# EAGLE schematic motherboard_cp2 (EAGLE 6.4)
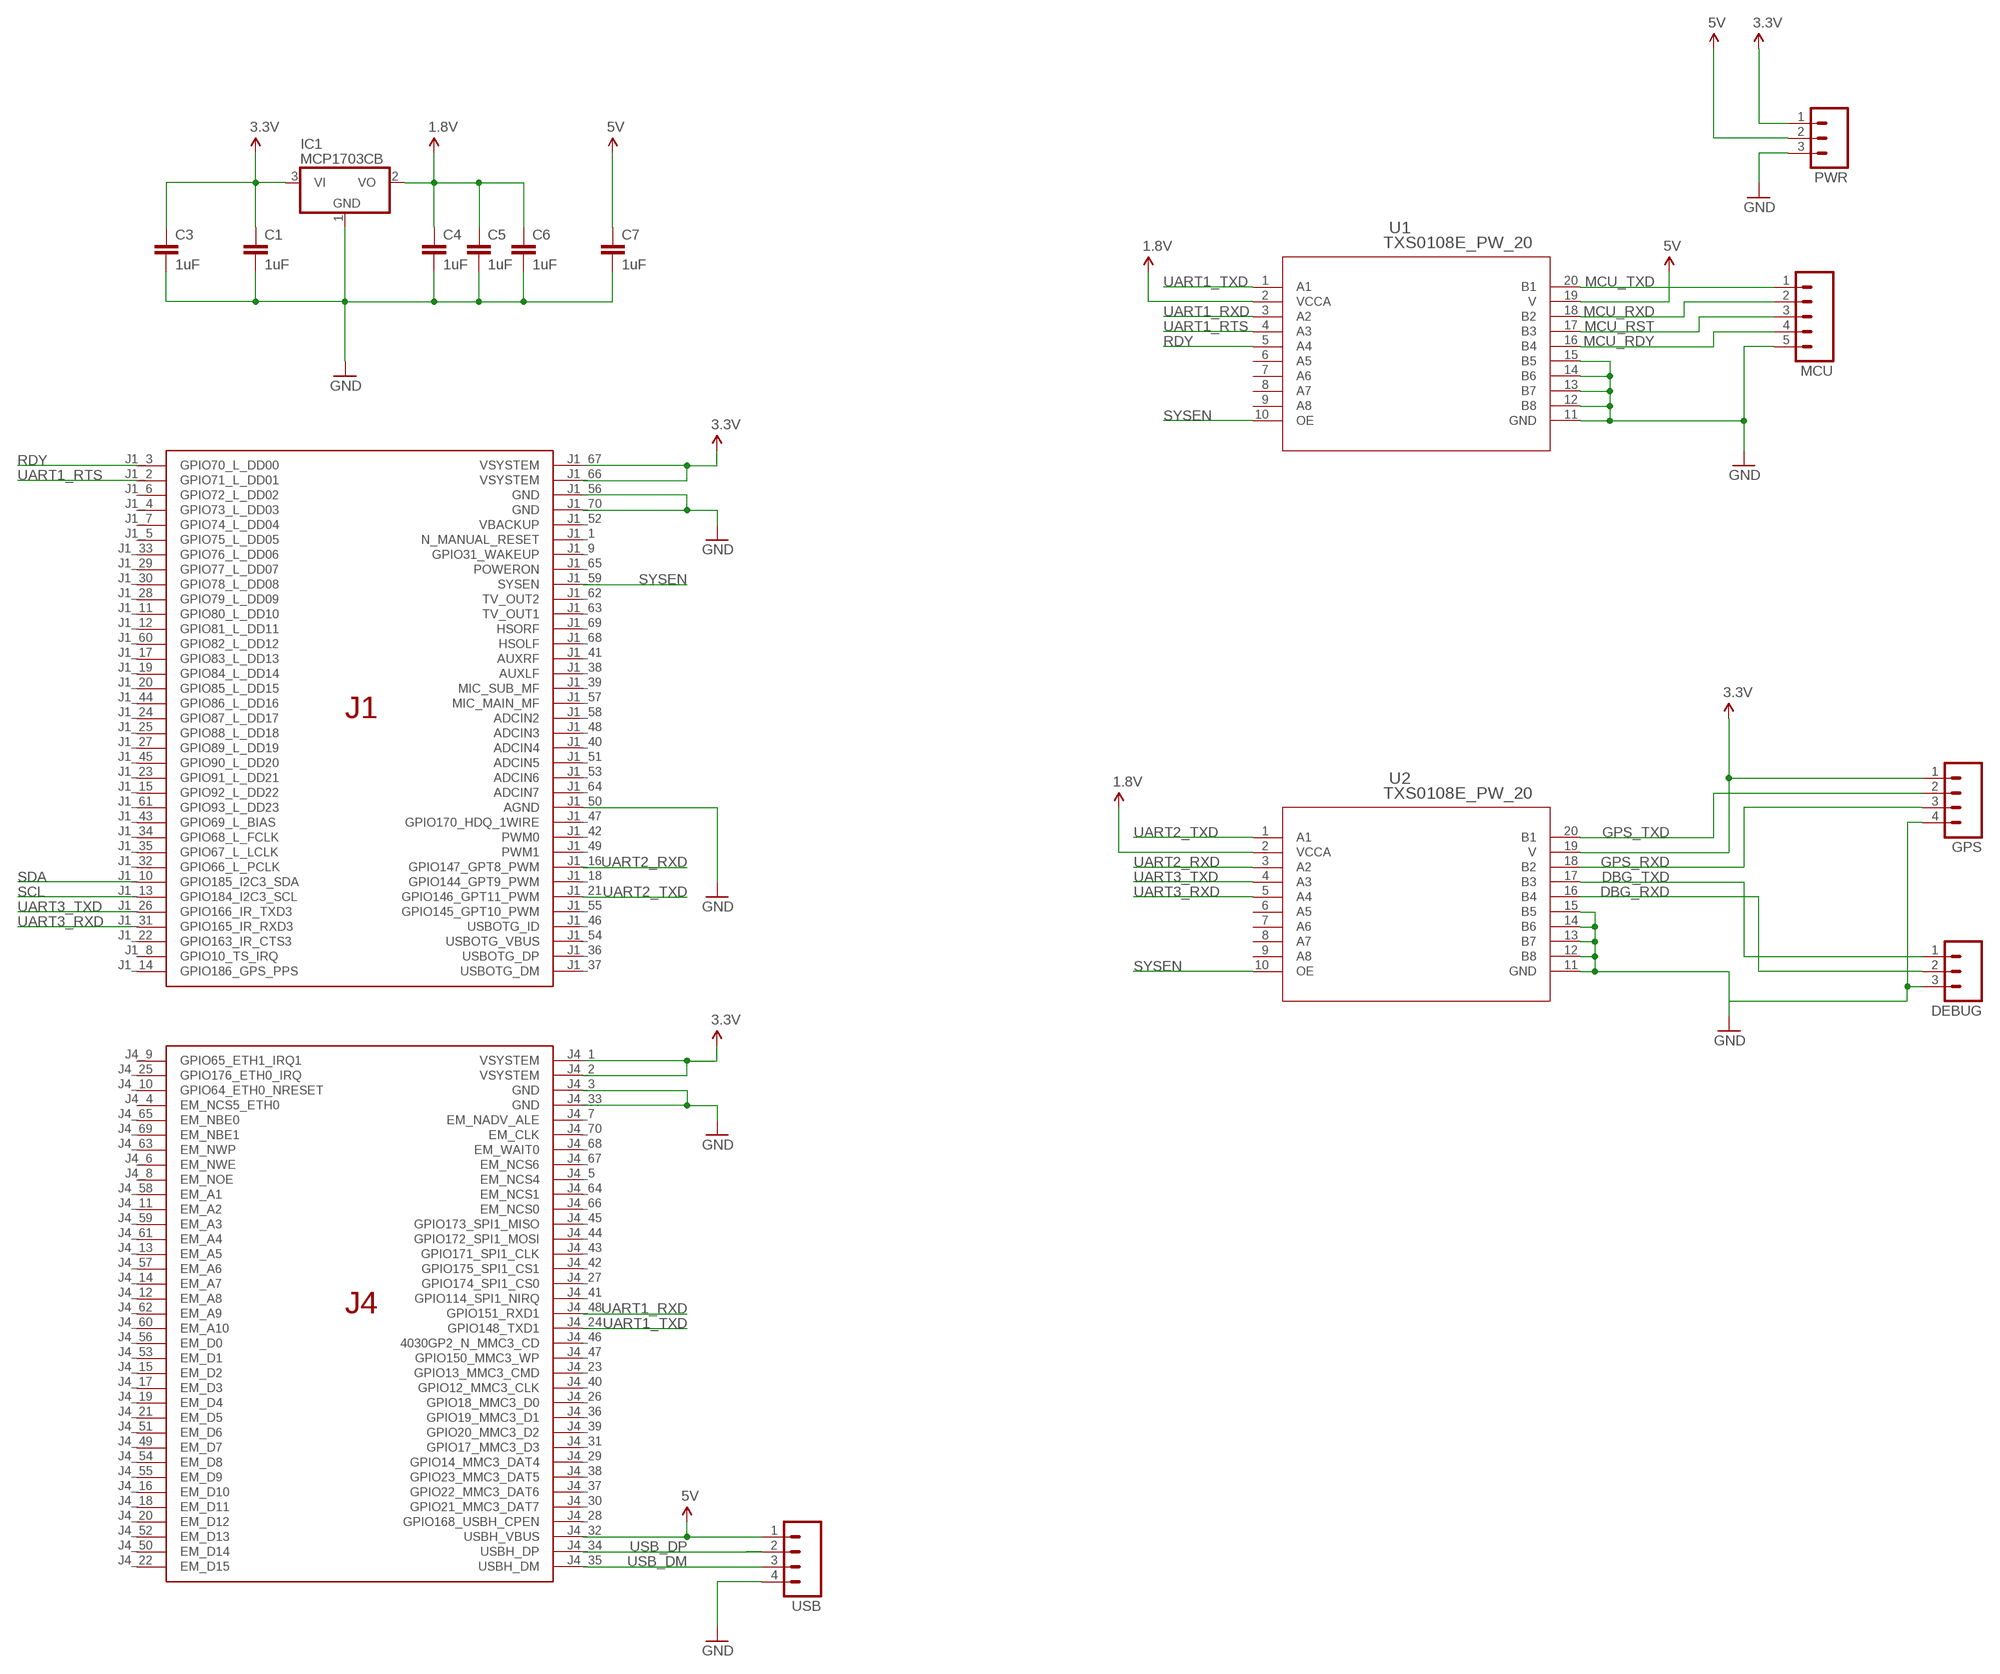
[diagram p0: schematic, sheet 1]

## Parts
C1  1uF  1UF-25V-10%(0805)  [0805]
C3  1uF  1UF-25V-10%(0805)  [0805]
C4  1uF  1UF-25V-10%(0805)  [0805]
C5  1uF  1UF-25V-10%(0805)  [0805]
C6  1uF  1UF-25V-10%(0805)  [0805]
C7  1uF  1UF-25V-10%(0805)  [0805]
DEBUG  M03LOCK_LONGPADS  [1X03_LOCK_LONGPADS]
GPS  M04LONGPADS  [1X04_LONGPADS]
IC1  MCP1703CB  [SOT23]
MCU  M05PTH_LONGPADS  [1X05_LONGPADS]
PWR  M03LONGPADS  [1X03_LONGPADS]
U1  TXS0108E_PW_20  [PW20]
U2  TXS0108E_PW_20  [PW20]
U$1  OVERO  [OVERO]
USB  M04LONGPADS  [1X04_LONGPADS]

## Nets
1.8V: C4.1 C5.1 C6.1 IC1.2(VO) U1.2(VCCA) U2.2(VCCA)
3.3V: C1.1 C3.1 GPS.1 IC1.3(VI) PWR.1 U2.19(V) U$1.J1_66(VSYSTEM) U$1.J1_67(VSYSTEM) U$1.J4_1(VSYSTEM) U$1.J4_2(VSYSTEM)
5V: C7.1 PWR.2 U1.19(V) U$1.J4_32(USBH_VBUS) USB.1
DBG_RXD: DEBUG.2 U2.16(B4)
DBG_TXD: DEBUG.1 U2.17(B3)
GND: C1.2 C3.2 C4.2 C5.2 C6.2 C7.2 DEBUG.3 GPS.4 IC1.1(GND) MCU.5 PWR.3 U1.11(GND) U1.12(B8) U1.13(B7) U1.14(B6) U1.15(B5) U2.11(GND) U2.12(B8) U2.13(B7) U2.14(B6) U2.15(B5) U$1.J1_50(AGND) U$1.J1_56(GND) U$1.J1_70(GND) U$1.J4_3(GND) U$1.J4_33(GND) USB.4
GPS_RXD: GPS.3 U2.18(B2)
GPS_TXD: GPS.2 U2.20(B1)
MCU_RDY: MCU.4 U1.16(B4)
MCU_RST: MCU.3 U1.17(B3)
MCU_RXD: MCU.2 U1.18(B2)
MCU_TXD: MCU.1 U1.20(B1)
RDY: U1.5(A4) U$1.J1_3(GPIO70_L_DD00)
SCL: U$1.J1_13(GPIO184_I2C3_SCL)
SDA: U$1.J1_10(GPIO185_I2C3_SDA)
SYSEN: U1.10(OE) U2.10(OE) U$1.J1_59(SYSEN)
UART1_RTS: U1.4(A3) U$1.J1_2(GPIO71_L_DD01)
UART1_RXD: U1.3(A2) U$1.J4_48(GPIO151_RXD1)
UART1_TXD: U1.1(A1) U$1.J4_24(GPIO148_TXD1)
UART2_RXD: U2.3(A2) U$1.J1_16(GPIO147_GPT8_PWM)
UART2_TXD: U2.1(A1) U$1.J1_21(GPIO146_GPT11_PWM)
UART3_RXD: U2.5(A4) U$1.J1_31(GPIO165_IR_RXD3)
UART3_TXD: U2.4(A3) U$1.J1_26(GPIO166_IR_TXD3)
USB_DM: U$1.J4_35(USBH_DM) USB.3
USB_DP: U$1.J4_34(USBH_DP) USB.2
Unconnected: U1.6(A5) U1.7(A6) U1.8(A7) U1.9(A8) U2.6(A5) U2.7(A6) U2.8(A7) U2.9(A8) U$1.J1_1(N_MANUAL_RESET) U$1.J1_4(GPIO73_L_DD03) U$1.J1_5(GPIO75_L_DD05) U$1.J1_6(GPIO72_L_DD02) U$1.J1_7(GPIO74_L_DD04) U$1.J1_8(GPIO10_TS_IRQ) U$1.J1_9(GPIO31_WAKEUP) U$1.J1_11(GPIO80_L_DD10) U$1.J1_12(GPIO81_L_DD11) U$1.J1_14(GPIO186_GPS_PPS) U$1.J1_15(GPIO92_L_DD22) U$1.J1_17(GPIO83_L_DD13) U$1.J1_18(GPIO144_GPT9_PWM) U$1.J1_19(GPIO84_L_DD14) U$1.J1_20(GPIO85_L_DD15) U$1.J1_22(GPIO163_IR_CTS3) U$1.J1_23(GPIO91_L_DD21) U$1.J1_24(GPIO87_L_DD17) U$1.J1_25(GPIO88_L_DD18) U$1.J1_27(GPIO89_L_DD19) U$1.J1_28(GPIO79_L_DD09) U$1.J1_29(GPIO77_L_DD07) U$1.J1_30(GPIO78_L_DD08) U$1.J1_32(GPIO66_L_PCLK) U$1.J1_33(GPIO76_L_DD06) U$1.J1_34(GPIO68_L_FCLK) U$1.J1_35(GPIO67_L_LCLK) U$1.J1_36(USBOTG_DP) U$1.J1_37(USBOTG_DM) U$1.J1_38(AUXLF) U$1.J1_39(MIC_SUB_MF) U$1.J1_40(ADCIN4) U$1.J1_41(AUXRF) U$1.J1_42(PWM0) U$1.J1_43(GPIO69_L_BIAS) U$1.J1_44(GPIO86_L_DD16) U$1.J1_45(GPIO90_L_DD20) U$1.J1_46(USBOTG_ID) U$1.J1_47(GPIO170_HDQ_1WIRE) U$1.J1_48(ADCIN3) U$1.J1_49(PWM1) U$1.J1_51(ADCIN5) U$1.J1_52(VBACKUP) U$1.J1_53(ADCIN6) U$1.J1_54(USBOTG_VBUS) U$1.J1_55(GPIO145_GPT10_PWM) U$1.J1_57(MIC_MAIN_MF) U$1.J1_58(ADCIN2) U$1.J1_60(GPIO82_L_DD12) U$1.J1_61(GPIO93_L_DD23) U$1.J1_62(TV_OUT2) U$1.J1_63(TV_OUT1) U$1.J1_64(ADCIN7) U$1.J1_65(POWERON) U$1.J1_68(HSOLF) U$1.J1_69(HSORF) U$1.J4_4(EM_NCS5_ETH0) U$1.J4_5(EM_NCS4) U$1.J4_6(EM_NWE) U$1.J4_7(EM_NADV_ALE) U$1.J4_8(EM_NOE) U$1.J4_9(GPIO65_ETH1_IRQ1) U$1.J4_10(GPIO64_ETH0_NRESET) U$1.J4_11(EM_A2) U$1.J4_12(EM_A8) U$1.J4_13(EM_A5) U$1.J4_14(EM_A7) U$1.J4_15(EM_D2) U$1.J4_16(EM_D10) U$1.J4_17(EM_D3) U$1.J4_18(EM_D11) U$1.J4_19(EM_D4) U$1.J4_20(EM_D12) U$1.J4_21(EM_D5) U$1.J4_22(EM_D15) U$1.J4_23(GPIO13_MMC3_CMD) U$1.J4_25(GPIO176_ETH0_IRQ) U$1.J4_26(GPIO18_MMC3_D0) U$1.J4_27(GPIO174_SPI1_CS0) U$1.J4_28(GPIO168_USBH_CPEN) U$1.J4_29(GPIO14_MMC3_DAT4) U$1.J4_30(GPIO21_MMC3_DAT7) U$1.J4_31(GPIO17_MMC3_D3) U$1.J4_36(GPIO19_MMC3_D1) U$1.J4_37(GPIO22_MMC3_DAT6) U$1.J4_38(GPIO23_MMC3_DAT5) U$1.J4_39(GPIO20_MMC3_D2) U$1.J4_40(GPIO12_MMC3_CLK) U$1.J4_41(GPIO114_SPI1_NIRQ) U$1.J4_42(GPIO175_SPI1_CS1) U$1.J4_43(GPIO171_SPI1_CLK) U$1.J4_44(GPIO172_SPI1_MOSI) U$1.J4_45(GPIO173_SPI1_MISO) U$1.J4_46(4030GP2_N_MMC3_CD) U$1.J4_47(GPIO150_MMC3_WP) U$1.J4_49(EM_D7) U$1.J4_50(EM_D14) U$1.J4_51(EM_D6) U$1.J4_52(EM_D13) U$1.J4_53(EM_D1) U$1.J4_54(EM_D8) U$1.J4_55(EM_D9) U$1.J4_56(EM_D0) U$1.J4_57(EM_A6) U$1.J4_58(EM_A1) U$1.J4_59(EM_A3) U$1.J4_60(EM_A10) U$1.J4_61(EM_A4) U$1.J4_62(EM_A9) U$1.J4_63(EM_NWP) U$1.J4_64(EM_NCS1) U$1.J4_65(EM_NBE0) U$1.J4_66(EM_NCS0) U$1.J4_67(EM_NCS6) U$1.J4_68(EM_WAIT0) U$1.J4_69(EM_NBE1) U$1.J4_70(EM_CLK)

## Library data of the parts
C1 C3-C7 = SparkFun-Capacitors:1UF-25V-10%(0805): CAP-08064; PROD_ID: CAP-08064
DEBUG PWR = SparkFun-Connectors:M03: Header 3 Standard 3-pin 0.1" header. Use with straight break away headers (SKU : PRT-00116), right angle break away headers (PRT-00553), swiss pins (PRT-00743), machine pins (PRT-00117), and female headers (PRT-00115). Molex polarized connector foot print use with SKU : PRT-08232 with associated crimp pins and housings.
GPS USB = SparkFun-Connectors:M04: Header 4 Standard 4-pin 0.1" header. Use with straight break away headers (SKU : PRT-00116), right angle break away headers (PRT-00553), swiss pins (PRT-00743), machine pins (PRT-00117), and female headers (PRT-00115). Molex polarized connector foot print use with SKU : PRT-08231 with associated crimp pins and housings. 1MM SMD Version SKU: PRT-10208
IC1 = linear:MCP1703: 250 mA, 16V, Low Quiescent Current LDO Regulator Source: http://ww1.microchip.com/downloads/en/DeviceDoc/22049b.pdf
MCU = SparkFun-Connectors:M05: Header 5 Standard 5-pin 0.1" header. Use with straight break away headers (SKU : PRT-00116), right angle break away headers (PRT-00553), swiss pins (PRT-00743), machine pins (PRT-00117), and female headers (PRT-00115). Molex polarized connector foot print use with SKU : PRT-08230 with associated crimp pins and housings.
U1 U2 = txs0108e:TXS0108E_PW_20; DATASHEETURL: http://www.ti.com/lit/gpn/TXS0108E; DESCRIPTION: 8-Bit Bidirectional Voltage-Level Translator For Open-Drain And Push-Pull Application; FAMILY_NAME: AUTO DIRECTION SENSING DUAL SUPPLY TRANSLATOR; GENERIC_PART_NUMBER: TXS0108E; INDUSTRY_STD_PKG_TYPE: TSSOP; MANUFACTURER: Texas Instruments; MANUFACTURER_PART_NUMBER: txs0108e_pw_20; PACKAGE_DESIGNATOR: PW; PIN_COUNT: 20; VENDOR: Texas Instruments
U$1 = overo:OVERO